# EAGLE design MainBoard (EAGLE 9.3.1)
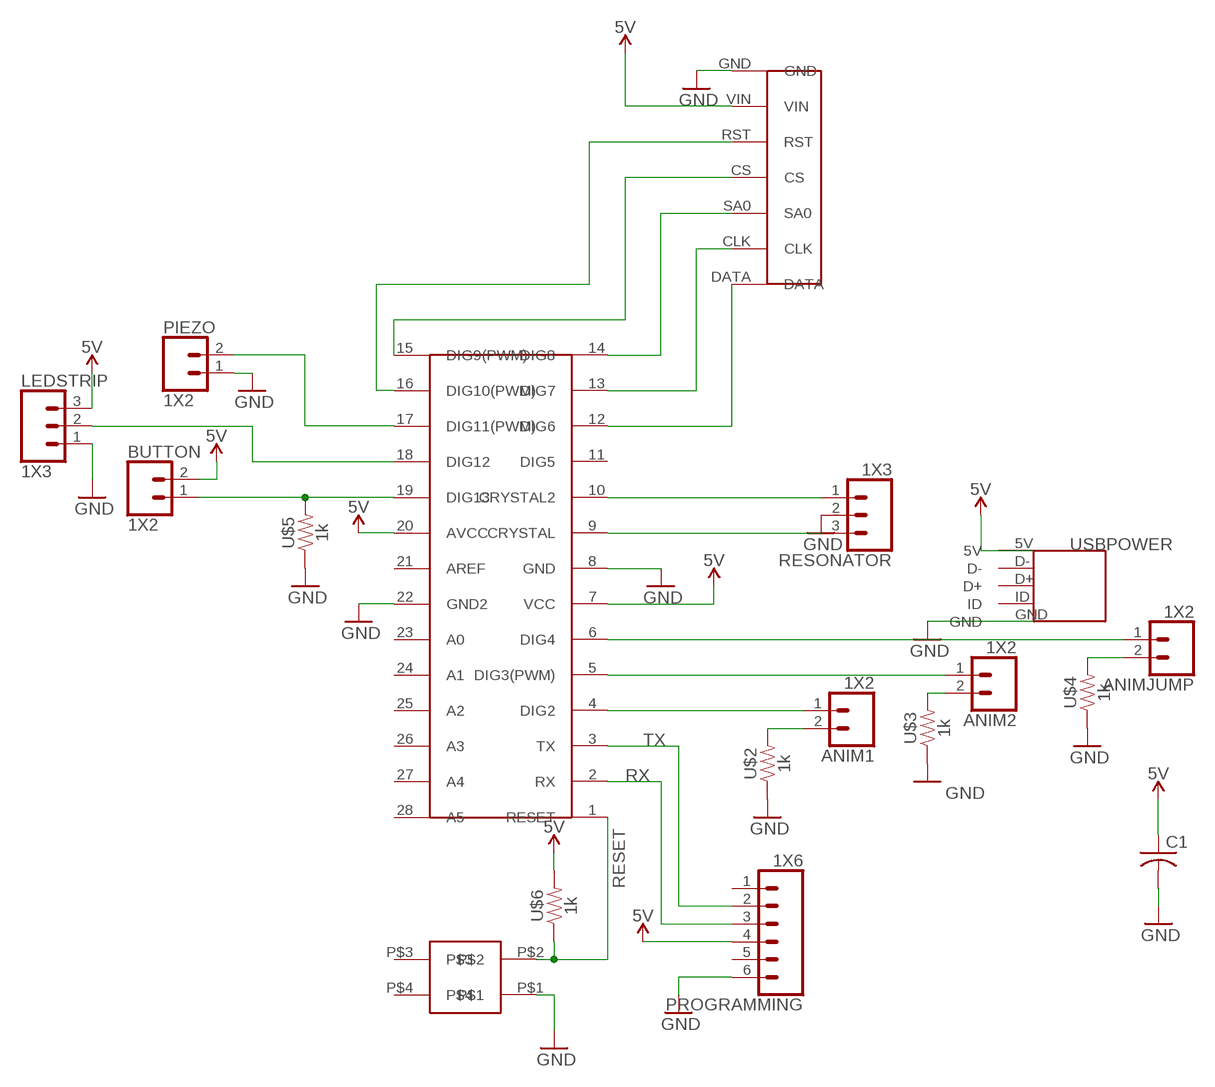
[diagram p0: schematic, sheet 1]

## Parts
ANIM1  1X2  [1X02_LONGPADS]
ANIM2  1X2  [1X02_LONGPADS]
ANIMJUMP  1X2  [1X02_LONGPADS]
BUTTON  1X2  [1X02_LONGPADS]
C1  C-US025-024X044  [C025-024X044]
LEDSTRIP  1X3  [1X03_NO_SILK]
OLED  OLED  [OLED]
PIEZO  1X2  [1X02_LONGPADS]
PROGRAMMING  1X6  [1X06_NO_SILK]
RESONATOR  1X3  [1X03_NO_SILK]
U$1  ATMEGA328  [ATMEGA328]
U$2  1k  RESISTOR  [AXIAL-0.3]
U$3  1k  RESISTOR  [AXIAL-0.3]
U$4  1k  RESISTOR  [AXIAL-0.3]
U$5  1k  RESISTOR  [AXIAL-0.3]
U$6  1k  RESISTOR  [AXIAL-0.3]
U$7  BUTTON  [BUTTON]
USBPOWER  USB  [USB]

## Nets
GND: C1.2 LEDSTRIP.1 OLED.GND PIEZO.1 PROGRAMMING.6 RESONATOR.2 U$1.8(GND) U$1.22(GND2) U$2.P$1 U$3.P$1 U$4.P$1 U$5.P$1 U$7.P$1 USBPOWER.GND
N$1: BUTTON.1 U$1.19(DIG13) U$5.P$2
N$2: LEDSTRIP.2 U$1.18(DIG12)
N$3: OLED.DATA U$1.12(DIG6)
N$4: OLED.CLK U$1.13(DIG7)
N$5: OLED.SA0 U$1.14(DIG8)
N$6: OLED.CS U$1.15(DIG9(PWM))
N$7: OLED.RST U$1.16(DIG10(PWM))
N$8: PIEZO.2 U$1.17(DIG11(PWM))
N$9: ANIM1.2 U$2.P$2
N$10: ANIM2.2 U$3.P$2
N$11: ANIMJUMP.2 U$4.P$2
N$12: ANIM1.1 U$1.4(DIG2)
N$13: ANIM2.1 U$1.5(DIG3(PWM))
N$14: ANIMJUMP.1 U$1.6(DIG4)
N$18: RESONATOR.3 U$1.9(CRYSTAL)
N$19: RESONATOR.1 U$1.10(CRYSTAL2)
RESET: U$1.1(RESET) U$6.P$1 U$7.P$2
RX: PROGRAMMING.3 U$1.2(RX)
TX: PROGRAMMING.2 U$1.3(TX)
USBPOWER: USBPOWER.5V ; supply symbol labelled 5V
VIN: BUTTON.2 C1.1 LEDSTRIP.3 OLED.VIN PROGRAMMING.4 U$1.7(VCC) U$1.20(AVCC) U$6.P$2 ; supply symbol labelled 5V
Unconnected: PROGRAMMING.1 PROGRAMMING.5 U$1.11(DIG5) U$1.21(AREF) U$1.23(A0) U$1.24(A1) U$1.25(A2) U$1.26(A3) U$1.27(A4) U$1.28(A5) U$7.P$3 U$7.P$4 USBPOWER.D+ USBPOWER.D- USBPOWER.ID

## Library data of the parts
ANIM1 ANIM2 ANIMJUMP BUTTON PIEZO = FroggyRun:1X2
C1 = rcl:C-US: CAPACITOR, American symbol; SPICEPREFIX: C
LEDSTRIP RESONATOR = FroggyRun:1X3
OLED = FroggyRun:OLED
PROGRAMMING = FroggyRun:1X6
U$1 = FroggyRun:ATMEGA328
U$2-U$6 = FroggyRun:RESISTOR
U$7 = FroggyRun:BUTTON
USBPOWER = FroggyRun:USB

## Net classes
0 default: width 0.635 mm

## Board
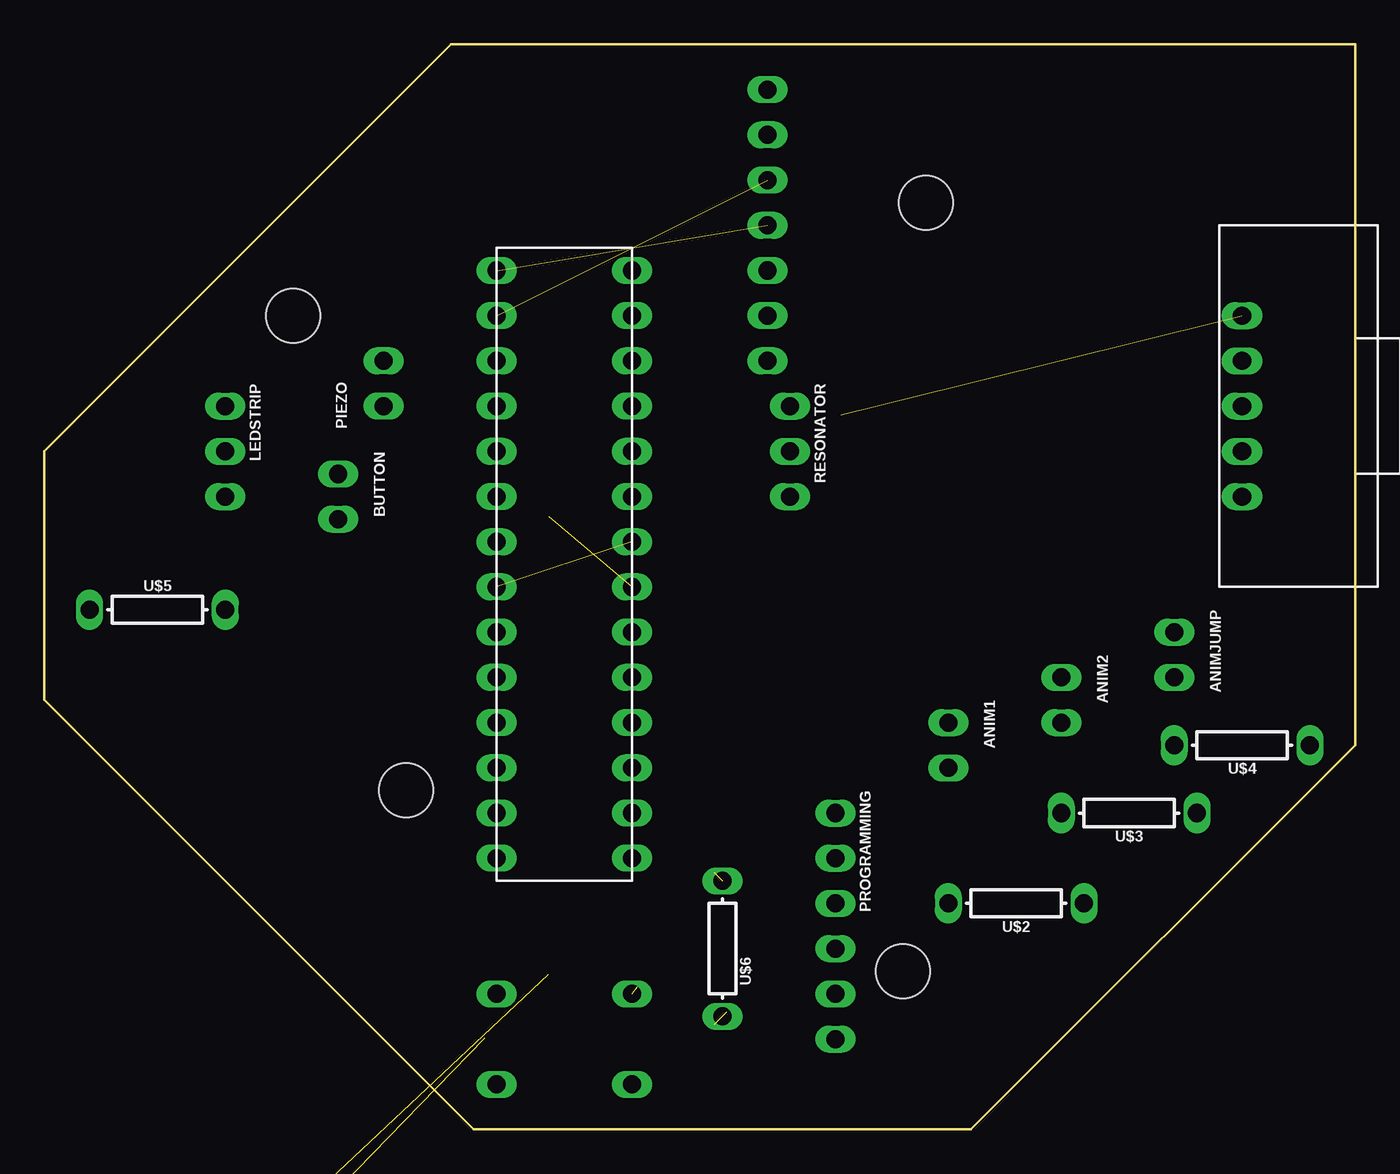
[diagram p1: board, top side]
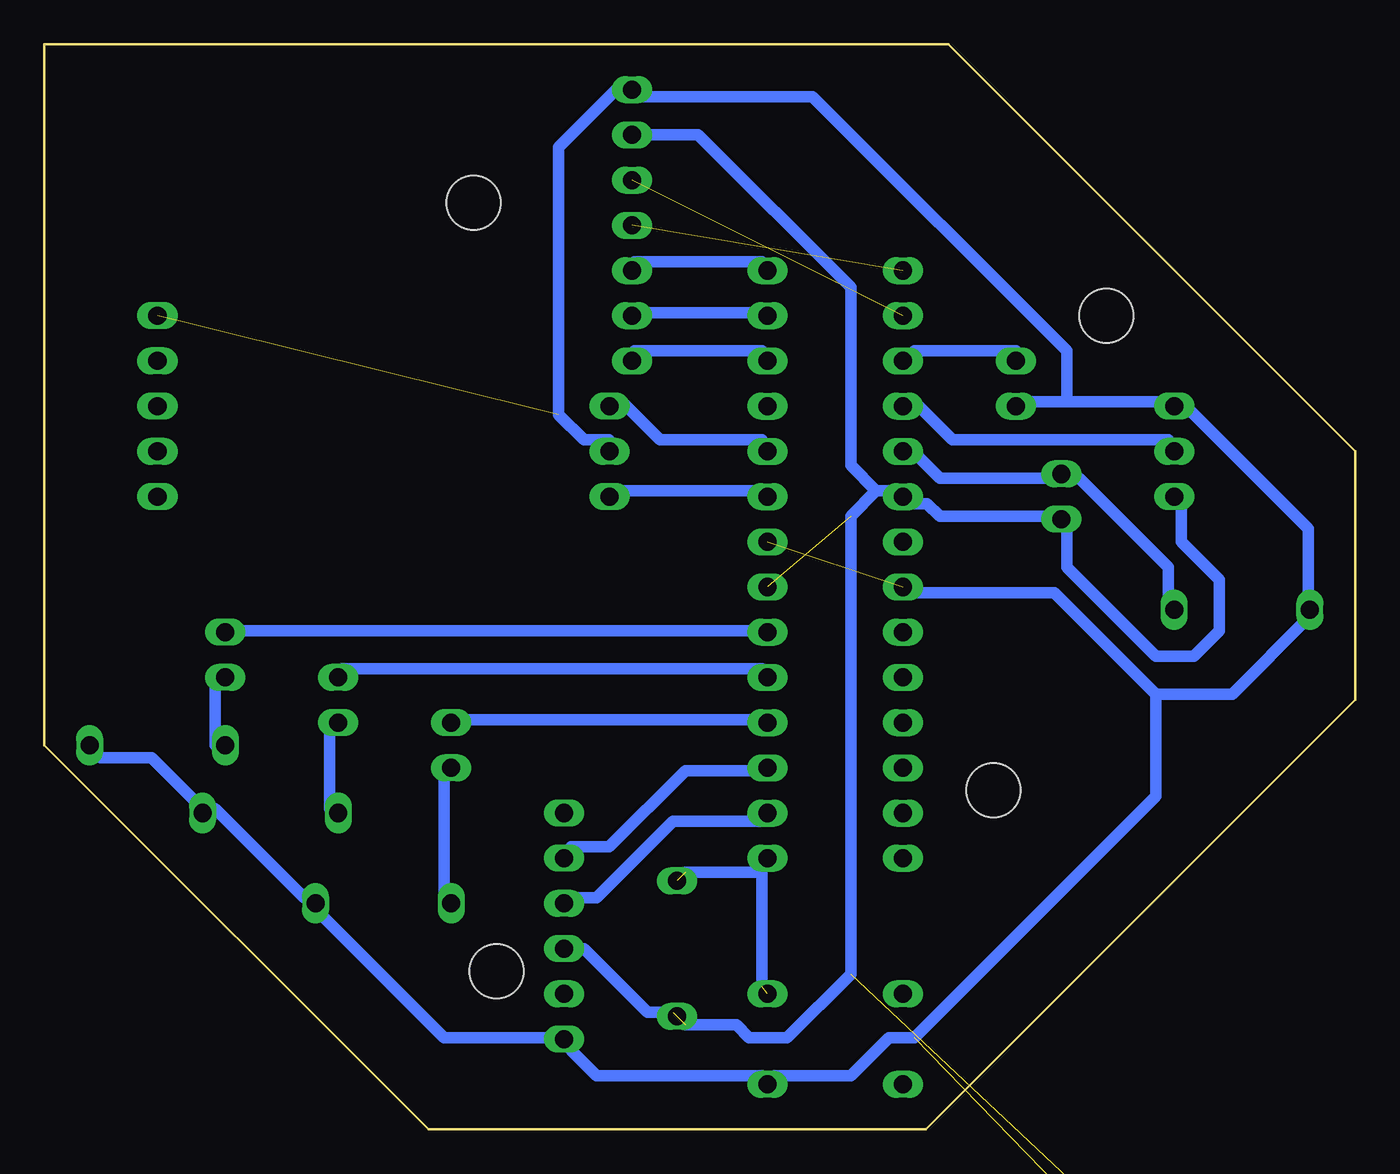
[diagram p2: board, bottom side, seen from below]

Size 73.66 x 60.96 mm. Coordinates in mm from the lower left corner, seen from the top.
Outline: 24.13,0 0,24.13 0,38.1 22.86,60.96 73.66,60.96 73.66,21.59 52.07,0 24.13,0
Copper layers (1*16): Top 0.035mm / dielectric 1.5mm / Bottom 0.035mm
Design rules "OthermillDRC_1_32_v2": minimum track width 8mil, minimum drill 0.8mm, track to track 0.794003125mm, track to pad 0.794003125mm, pad to pad 0.794003125mm, via to via 0.794003125mm, smd to smd 0mil, copper to edge 0mil, drill to drill 1mil, minimum pad ring 10mil, minimum via ring 10mil, stop-mask expansion 1mil, vias tented up to drill 30mil, thermal gap 10mil
Holes 3.05 mm at 48.26,8.89 49.53,52.07 20.32,19.05 13.97,45.72

### Footprints (pad centres in the part's own frame; a part is rotated, then mirrored left to right if it is on the bottom)
1X02_LONGPADS = drill 1.016 long: 1 0,0; 2 2.54,0
C025-024X044 = drill 0.813 octagon: 1 -1.27,0; 2 1.27,0
1X03_NO_SILK = drill 1.016 long: 1 0,0; 2 2.54,0; 3 5.08,0
OLED = drill 1.016 long: CLK 3.81,2.54; CS 8.89,2.54; DATA 1.27,2.54; GND 16.51,2.54; RST 11.43,2.54; SA0 6.35,2.54; VIN 13.97,2.54
1X06_NO_SILK = drill 1.016 long: 1 0,0; 2 2.54,0; 3 5.08,0; 4 7.62,0; 5 10.16,0; 6 12.7,0
ATMEGA328 = drill 1.016 long: 1 1.27,1.27; 2 3.81,1.27; 3 6.35,1.27; 4 8.89,1.27; 5 11.43,1.27; 6 13.97,1.27; 7 16.51,1.27; 8 19.05,1.27; 9 21.59,1.27; 10 24.13,1.27; 11 26.67,1.27; 12 29.21,1.27; 13 31.75,1.27; 14 34.29,1.27; 15 34.29,8.89; 16 31.75,8.89; 17 29.21,8.89; 18 26.67,8.89; 19 24.13,8.89; 20 21.59,8.89; 21 19.05,8.89; 22 16.51,8.89; 23 13.97,8.89; 24 11.43,8.89; 25 8.89,8.89; 26 6.35,8.89; 27 3.81,8.89; 28 1.27,8.89
AXIAL-0.3 = drill 1.016 long: P$1 -3.81,0; P$2 3.81,0
BUTTON = drill 1.016 long: P$1 0,0; P$2 5.08,0; P$3 5.08,7.62; P$4 0,7.62
USB = drill 1.016 long: 5V 5.08,-2.54; D+ 0,-2.54; D- 2.54,-2.54; GND -5.08,-2.54; ID -2.54,-2.54

### Placement (x,y rotation side)
ANIM1  50.8,22.86 270 top
ANIM2  57.15,25.4 270 top
ANIMJUMP  63.5,27.94 270 top
BUTTON  16.51,36.83 270 top
C1  0,-19.05 0 top  (outside the outline)
LEDSTRIP  10.16,40.64 270 top
OLED  43.18,41.91 90 top
PIEZO  19.05,40.64 90 top
PROGRAMMING  44.45,17.78 270 top
RESONATOR  41.91,40.64 270 top
U$1  34.29,13.97 90 top
U$2  54.61,12.7 180 top
U$3  60.96,17.78 180 top
U$4  67.31,21.59 180 top
U$5  6.35,29.21 0 top
U$6  38.1,10.16 270 top
U$7  33.02,2.54 90 top
USBPOWER  69.85,40.64 270 top

### Tracks (layer width: path | path; a pad name or v marks a point on that pad's centre or on a via)
GND  (3 unrouted)
  Bottom 0.635: U$4.P$1 70.5,20.88 67.64,20.88 64.78,18.02 U$3.P$1 64.07,18.02 59.07,13.02 U$2.P$1 58.35,12.3 51.21,5.16 44.78,5.16 PROGRAMMING.6 44.06,4.45 42.63,3.02 33.34,3.02 U$7.P$1 32.63,3.02 28.34,3.02 26.2,5.16 24.77,5.16 11.2,18.74 11.2,24.45 | RESONATOR.2 41.92,38.74 43.35,38.74 44.78,40.17 44.78,55.18 41.2,58.75 OLED.GND 40.49,58.03 30.49,58.03 16.2,43.74 16.2,40.89 | 16.2,40.89 10.48,40.89 LEDSTRIP.1 9.76,40.89 2.62,33.74 2.62,29.45 U$5.P$1 2.62,28.74 6.91,24.45 11.2,24.45 | 16.2,40.89 18.34,40.89 PIEZO.1 | 11.2,24.45 16.91,30.17 24.77,30.17 U$1.22
N$1
  Bottom 0.635: U$5.P$2 10.48,29.45 10.48,31.6 15.48,36.6 16.2,36.6 BUTTON.1 16.91,36.6 23.34,36.6 24.77,38.03 U$1.19
N$2
  Bottom 0.635: LEDSTRIP.2 10.48,38.74 22.63,38.74 24.77,40.89 U$1.18
N$3
  Bottom 0.635: U$1.12 33.34,43.74 40.49,43.74 OLED.DATA
N$4
  Bottom 0.635: U$1.13 33.34,45.89 40.49,45.89 OLED.CLK
N$5
  Bottom 0.635: U$1.14 33.34,48.74 40.49,48.74 OLED.SA0
N$6  (1 unrouted)
N$7  (1 unrouted)
N$8
  Bottom 0.635: PIEZO.2 19.05,43.74 24.77,43.74 U$1.17
N$9
  Bottom 0.635: U$2.P$2 51.21,13.02 51.21,20.16 ANIM1.2
N$10
  Bottom 0.635: U$3.P$2 57.64,18.02 57.64,22.31 ANIM2.2
N$11
  Bottom 0.635: U$4.P$2 64.07,21.59 64.07,25.17 ANIMJUMP.2
N$12
  Bottom 0.635: U$1.4 33.34,23.02 50.49,23.02 ANIM1.1
N$13
  Bottom 0.635: U$1.5 33.34,25.88 56.92,25.88 ANIM2.1
N$14
  Bottom 0.635: U$1.6 33.34,28.02 63.35,28.02 ANIMJUMP.1
N$18
  Bottom 0.635: U$1.9 33.34,35.88 41.2,35.88 RESONATOR.3
N$19
  Bottom 0.635: U$1.10 33.34,38.74 39.06,38.74 41.2,40.89 RESONATOR.1
RESET  (2 unrouted)
  Bottom 0.635: 33.34,14.45 33.34,15.16 U$1.1 | 33.34,14.45 33.34,8.02 | 33.34,14.45 37.63,14.45
RX
  Bottom 0.635: PROGRAMMING.3 44.06,13.02 42.63,13.02 38.35,17.31 33.34,17.31 U$1.2
TX
  Bottom 0.635: PROGRAMMING.2 44.06,15.88 41.92,15.88 37.63,20.16 33.34,20.16 U$1.3
VIN  (4 unrouted)
  Bottom 0.635: 38.35,6.59 39.77,6.59 43.35,10.16 44.06,10.16 PROGRAMMING.4 | LEDSTRIP.3 9.76,35.17 9.76,33.03 7.62,30.88 7.62,28.02 9.05,26.6 11.2,26.6 16.2,31.6 16.2,33.74 BUTTON.2 16.91,34.45 23.34,34.45 24.06,35.17 24.77,35.17 U$1.20 25.48,35.88 26.91,35.88 | 26.91,35.88 28.34,37.31 28.34,47.32 36.92,55.89 40.49,55.89 OLED.VIN | 37.63,5.88 34.77,5.88 34.06,5.16 31.92,5.16 28.34,8.73 28.34,34.45 26.91,35.88